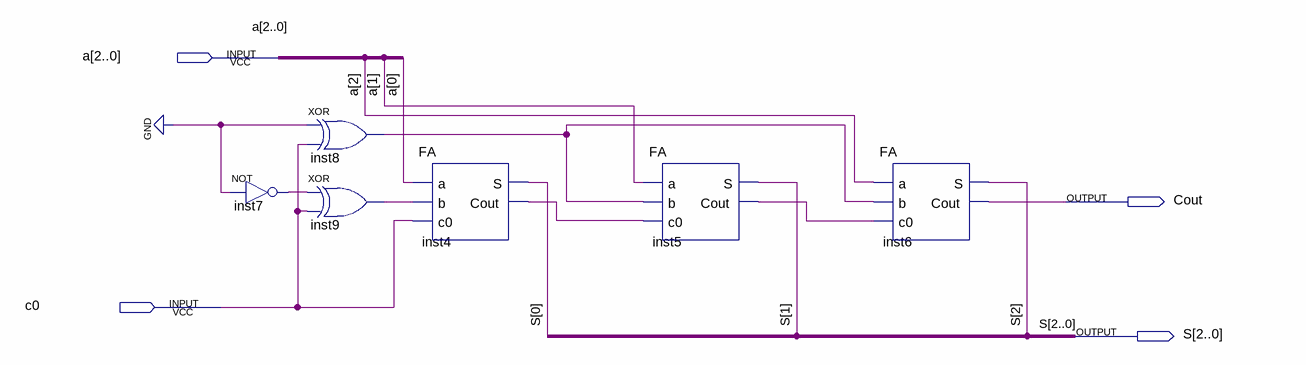
[diagram p0: schematic sheet]
// Quartus schematic threeBitBinaryAdder.bdf as structural Verilog: 6 symbols, 4 pins
module threeBitBinaryAdder (
  input  [2:0] a,
  input  c0,
  output Cout,
  output [2:0] S
);

  wire inst4_cout, inst5_cout, inst7_out, inst8_out, inst9_out;

  not inst7 (inst7_out, 1'b0);
  xor inst8 (inst8_out, 1'b0, c0);
  xor inst9 (inst9_out, inst7_out, c0);
  FA inst4 (.a(a[0]), .b(inst9_out), .c0(c0), .S(S[0]), .Cout(inst4_cout));
  FA inst5 (.a(a[1]), .b(inst8_out), .c0(inst4_cout), .S(S[1]), .Cout(inst5_cout));
  FA inst6 (.a(a[2]), .b(inst8_out), .c0(inst5_cout), .S(S[2]), .Cout(Cout));
endmodule
